# EAGLE design 12vAC_light (EAGLE 8.5.1)
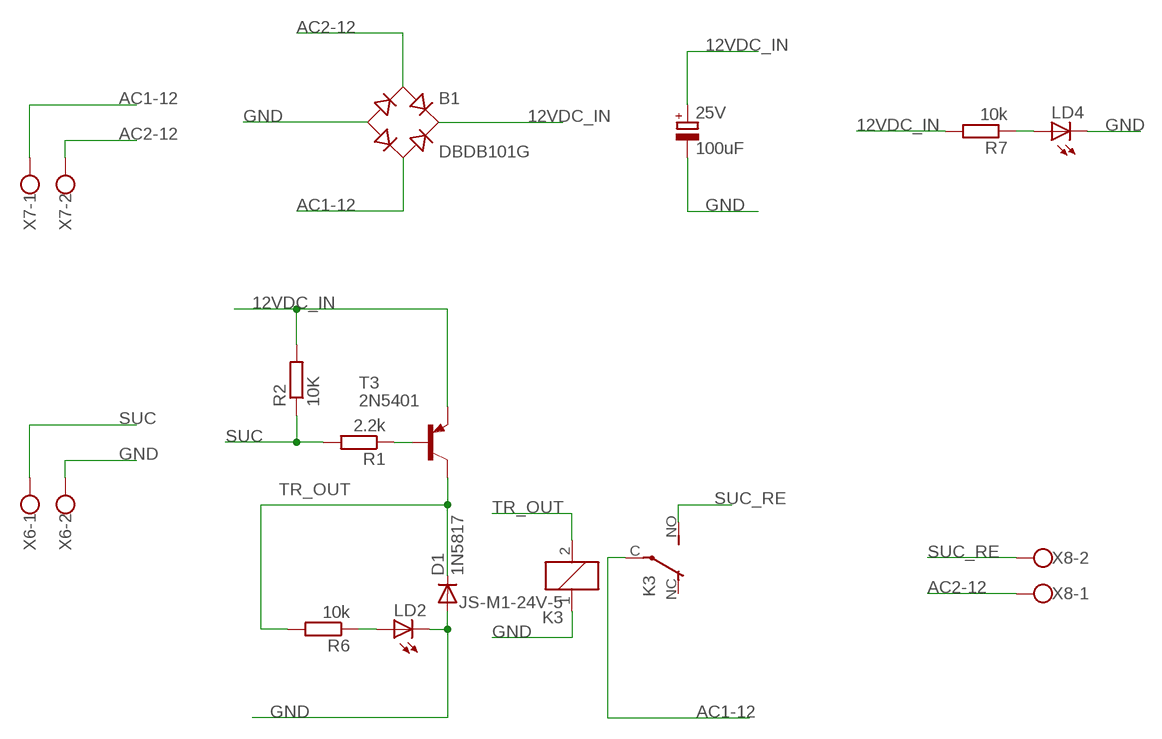
[diagram p0: schematic, sheet 1]

## Parts
25V  100uF  CPOL-EUE3.5-8  [E3,5-8]
B1  DBDB101G  [DB]
D1  1N5817  1N4004  [DO41-10]
K3  JS-M1-24V-5  JS-M1-12V-5  [JS-M]
LD2  LED5MM  [LED5MM]
LD4  LED5MM  [LED5MM]
R1  2.2k  R-EU_0207/10  [0207/10]
R2  10K  R-EU_0207/10  [0207/10]
R6  10k  R-EU_0207/10  [0207/10]
R7  10k  R-EU_0207/10  [0207/10]
T3  2N5401  2N5401-PNP-TO92-EBC  [TO92-EBC]
X6  W237-102  [W237-102]
X7  W237-102  [W237-102]
X8  W237-102  [W237-102]

## Nets
12VDC_IN: 25V.+ B1.+ R2.2 R7.2 T3.E
AC1-12: B1.AC2 K3.C(2:P) X7.1
AC2-12: B1.AC1 X7.2 X8.1
GND: 25V.- B1.- D1.A K3.1 LD2.K(C) LD4.K(C) X6.2
N$7: R1.1 T3.B
N$8: LD4.A R7.1
N$9: LD2.A R6.1
SUC: R1.2 R2.1 X6.1
SUC_RE: K3.NO(2:S) X8.2
TR_OUT: D1.C K3.2 R6.2 T3.C
Unconnected: K3.NC(2:O)

## Library data of the parts
25V = rcl:CPOL-EU: POLARIZED CAPACITOR, European symbol; SPICEPREFIX: C
B1 = rectifier:DB?*G: Single Phase 1.0 AMP Glass Passivated Bridge Rectifier Taiwan Semiconductor Co.,Ltd. - TSC Source: http://www.taiwansemi.com/TSCbig5/ezcatfiles/cust/img/img/db101g.pdf http://www.ts.com.tw/db/pictures/modules/PDT/PDT060207001/DBLS201G.pdf
D1 = adafruit:1N4004: DIODE General purpose 1N400x type rectifier (With bigger pads) http://www.ladyada.net/library/pcb/eaglelibrary.html
K3 = relay:JS-M1*: Automotive Ultra-Miniature Power Relay NAiS Source: http://www.mew-europe.com/.. en_ds_61211_0000.pdf; MF: FARNELL; MPN: JSM1-12V-5; OC_FARNELL: 910351; OC_NEWARK: 14J1764
LD2 LD4 = led:LED: LED OSRAM: - CHIPLED LG R971, LG N971, LY N971, LG Q971, LY Q971, LO R971, LY R971 LH N974, LH R974 LS Q976, LO Q976, LY Q976 LO Q996 - Hyper CHIPLED LW Q18S LB Q993, LB Q99A, LB R99A - SideLED LS A670, LO A670, LY A670, LG A670, LP A670 LB A673, LV A673, LT A673, LW A673 LH A674 LY A675 LS A676, LA A676, LO A676, LY A676, LW A676 LS A679, LY A679, LG A679 - Hyper Micro SIDELED® LS Y876, LA Y876, LO Y876, LY Y876 LT Y87S - SmartLED LW L88C, LW L88S LB L89C, LB L89S, LG L890 LS L89K, LO L89K, LY L89K LS L896, LA L896, LO L896, LY L896 - TOPLED LS T670, LO T670, LY T670, LG T670, LP T670 LSG T670, LSP T670, LSY T670, LOP T670, LYG T670 LG T671, LOG T671, LSG T671 LB T673, LV T673, LT T673, LW T673 LH T674 LS T676, LA T676, LO T676, LY T676, LB T676, LH T676, LSB T676, LW T676 LB T67C, LV T67C, LT T67C, LS T67K, LO T67K, LY T67K, LW E67C LS E67B, LA E67B, LO E67B, LY E67B, LB E67C, LV E67C, LT E67C LW T67C LS T679, LY T679, LG T679 LS T770, LO T770, LY T770, LG T770, LP T770 LB T773, LV T773, LT T773, LW T773 LH T774 LS E675, LA E675, LY E675, LS T675 LS T776, LA T776, LO T776, LY T776, LB T776 LHGB T686 LT T68C, LB T68C - Hyper Mini TOPLED® LB M676 - Mini TOPLED Santana® LG M470 LS M47K, LO M47K, LY M47K Source: http://www.osram.convergy.de/
R1 R2 R6 R7 = rcl-2:R-EU_: RESISTOR, European symbol
T3 = transistor-neu-to92:*-PNP-: PNP Transistror
X6-X8 = con-wago-500:W237-102: WAGO SCREW CLAMP

## Board
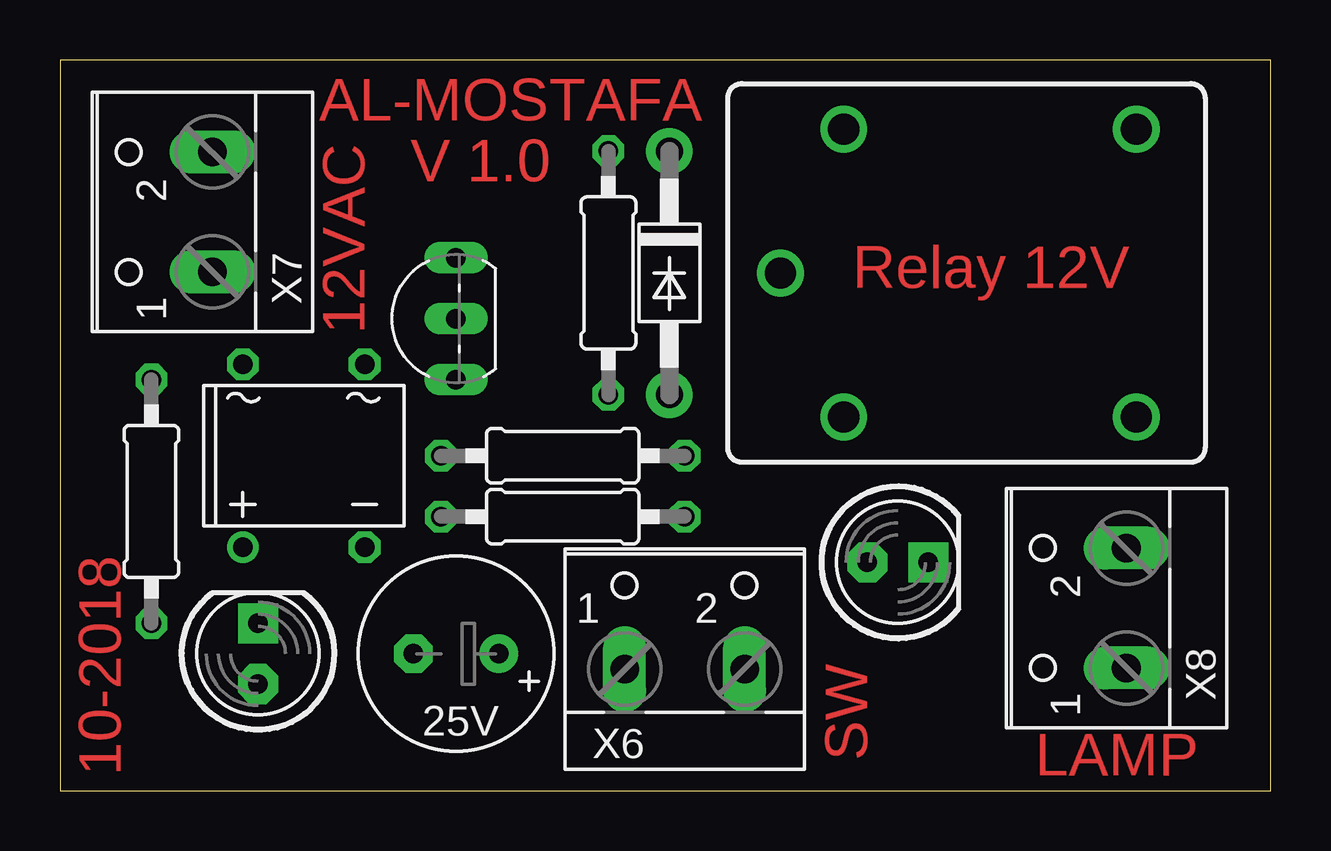
[diagram p1: board, top side]
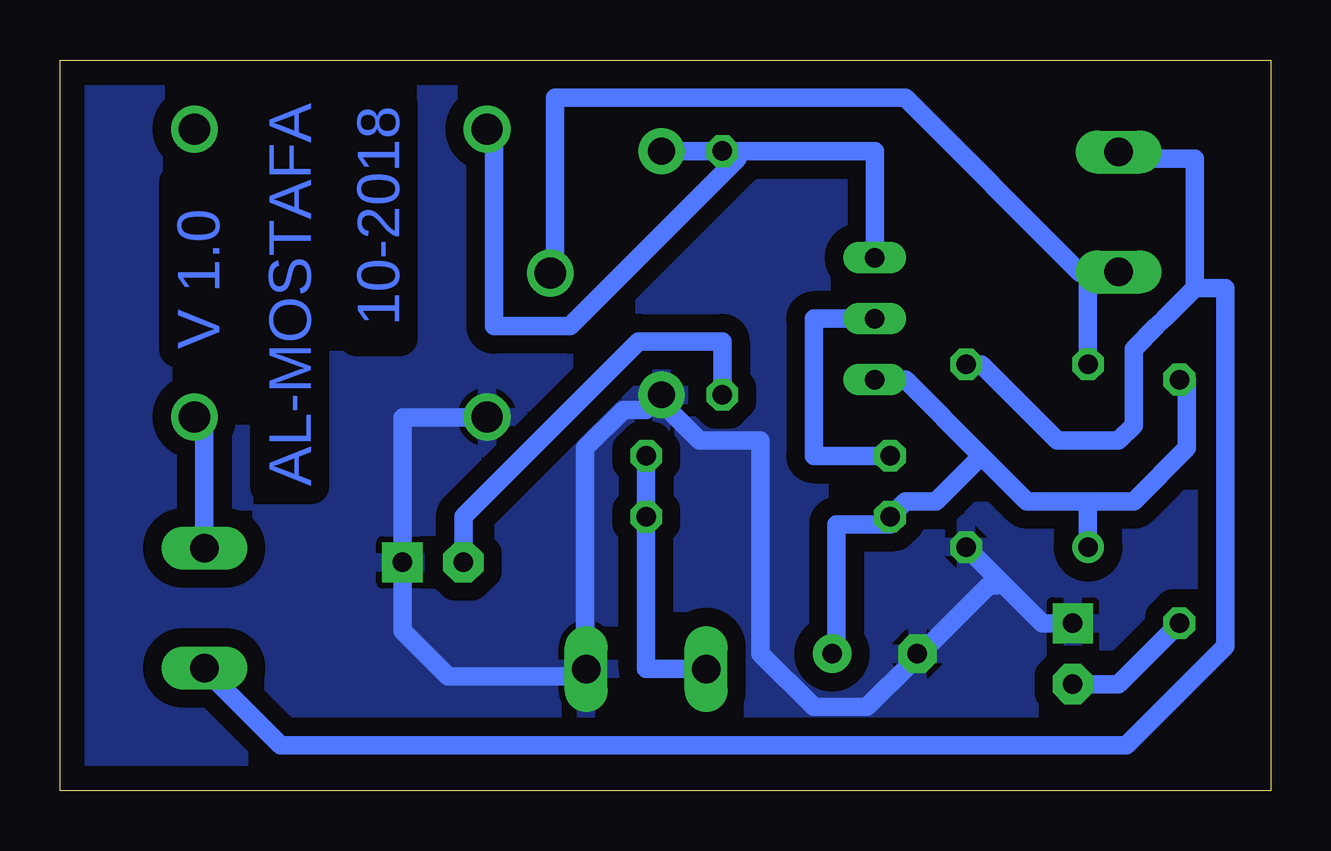
[diagram p2: board, bottom side, seen from below]

Size 50.47 x 30.47 mm. Coordinates in mm from the lower left corner, seen from the top.
Outline: 0,0 50.47,0 50.47,30.47 0,30.47 0,0
Copper layers (1*16): Top 0.035mm / dielectric 1.5mm / Bottom 0.035mm
Design rules "default *": minimum track width 30mil, minimum drill 0.35mm, track to track 30mil, track to pad 30mil, pad to pad 6mil, via to via 6mil, smd to smd 6mil, copper to edge 40mil, drill to drill 6mil, minimum pad ring 10mil, minimum via ring 8mil, stop-mask expansion 4mil, vias tented up to drill 0mil, thermal gap 10mil

### Footprints (pad centres in the part's own frame; a part is rotated, then mirrored left to right if it is on the bottom)
E3,5-8 = drill 0.813 pad 1.6: + -1.778,0 | drill 0.813 pad 1.6 octagon: - 1.778,0
DB = drill 0.813: + -2.54,-3.81 | drill 0.813 octagon: - 2.54,-3.81; AC1 2.54,3.81; AC2 -2.54,3.81
DO41-10 = drill 1.118 pad 1.93: A 5.08,0; C -5.08,0
JS-M = drill 1.3: 1 6.7,6; 2 6.7,-6; C 9.335,0; NC -5.5,-6; NO -5.5,6
LED5MM = drill 0.813 pad 1.676 octagon: A -1.27,0 | drill 0.813 pad 1.676 square: K 1.27,0
0207/10 = drill 0.813 octagon: 1 -5.08,0; 2 5.08,0
TO92-EBC = drill 0.813 long: B 0,-1.27; C 2.54,-1.27; E -2.54,-1.27
W237-102 = drill 1.194 long: 1 -2.5,-1.27; 2 2.5,-1.27

### Placement (x,y rotation side)
25V  16.51,5.71 180 top
B1  10.16,13.97 0 top
D1  25.4,21.59 270 top
K3  39.37,21.59 180 top
LD2  34.92,9.53 0 top
LD4  8.26,5.71 90 top
R1  20.95,13.97 0 top
R2  20.95,11.43 180 top
R6  22.86,21.59 90 top
R7  3.81,12.06 90 top
T3  15.24,19.68 90 top
X6  26.04,6.35 0 top
X7  5.08,24.13 90 top
X8  43.18,7.62 90 top

### Tracks (layer width: path | path; a pad name or v marks a point on that pad's centre or on a via)
12VDC_IN
  Bottom 0.762: R7.2 3.49,17.14 3.49,14.29 5.71,12.06 7.62,12.06 | 25V.+ 18.1,5.71 18.1,11.11 15.88,11.11 R2.2 15.24,12.06 13.97,12.06 12.06,13.97 | B1.+ 7.62,12.06 | 12.06,13.97 10.16,12.06 7.62,12.06 | 12.06,13.97 15.24,17.14 T3.E
AC1-12
  Bottom 0.762: B1.AC2 7.62,21.59 6.35,21.59 X7.1 7.94,21.59 15.24,28.89 29.84,28.89 29.84,21.59 K3.C
AC2-12
  Bottom 0.762: 3.17,20.95 4.45,19.68 4.76,19.37 5.71,18.41 5.71,15.24 6.35,14.61 8.89,14.61 12.06,17.78 B1.AC1 | 3.17,20.95 3.17,26.35 6.35,26.35 X7.2 | 3.17,20.95 1.91,20.95 1.91,6.03 6.03,1.91 41.27,1.91 44.45,5.08 X8.1
GND
  Bottom 0.762: 11.27,8.73 9.53,6.99 LD4.K | 11.27,8.73 B1.- | 11.27,8.73 11.43,8.57 11.75,8.57 14.61,5.71 25V.- 14.92,5.4 16.83,3.49 19.05,3.49 21.27,5.71 21.27,14.61 23.81,14.61 25.4,16.19 D1.A 26.04,15.88 26.99,15.88 28.57,14.29 28.57,5.4 X6.2 28.57,5.08 28.89,4.76 34.29,4.76 36.2,6.67 LD2.K 36.2,15.56 32.7,15.56 K3.1
  pour Bottom: 0.64,30.48 0,29.84 0,0 50.16,0 50.16,30.48
N$7
  Bottom 0.762: T3.B 19.05,19.68 19.05,13.97 R1.1
N$8
  Bottom 0.762: R7.1 6.35,4.45 LD4.A
N$9
  Bottom 0.762: R6.1 22.86,18.73 26.35,18.73 33.66,11.43 LD2.A
SUC
  Bottom 0.762: R1.2 R2.1 26.04,5.08 X6.1
SUC_RE
  Bottom 0.762: X8.2 44.45,15.56 44.77,15.56 K3.NO
TR_OUT
  Bottom 0.762: T3.C 16.51,26.67 22.23,26.67 | 22.23,26.67 R6.2 D1.C | K3.2 32.38,27.3 32.38,19.37 29.21,19.37 22.23,26.35 22.23,26.67

### Text on the board
Top: AL-MOSTAFA | V 1.0 | Relay 12V | 12VAC | 10-2018 | SW | LAMP
Bottom: 10-2018 | V 1.0 | AL-MOSTAFA